# EAGLE schematic carret (EAGLE 5.06)
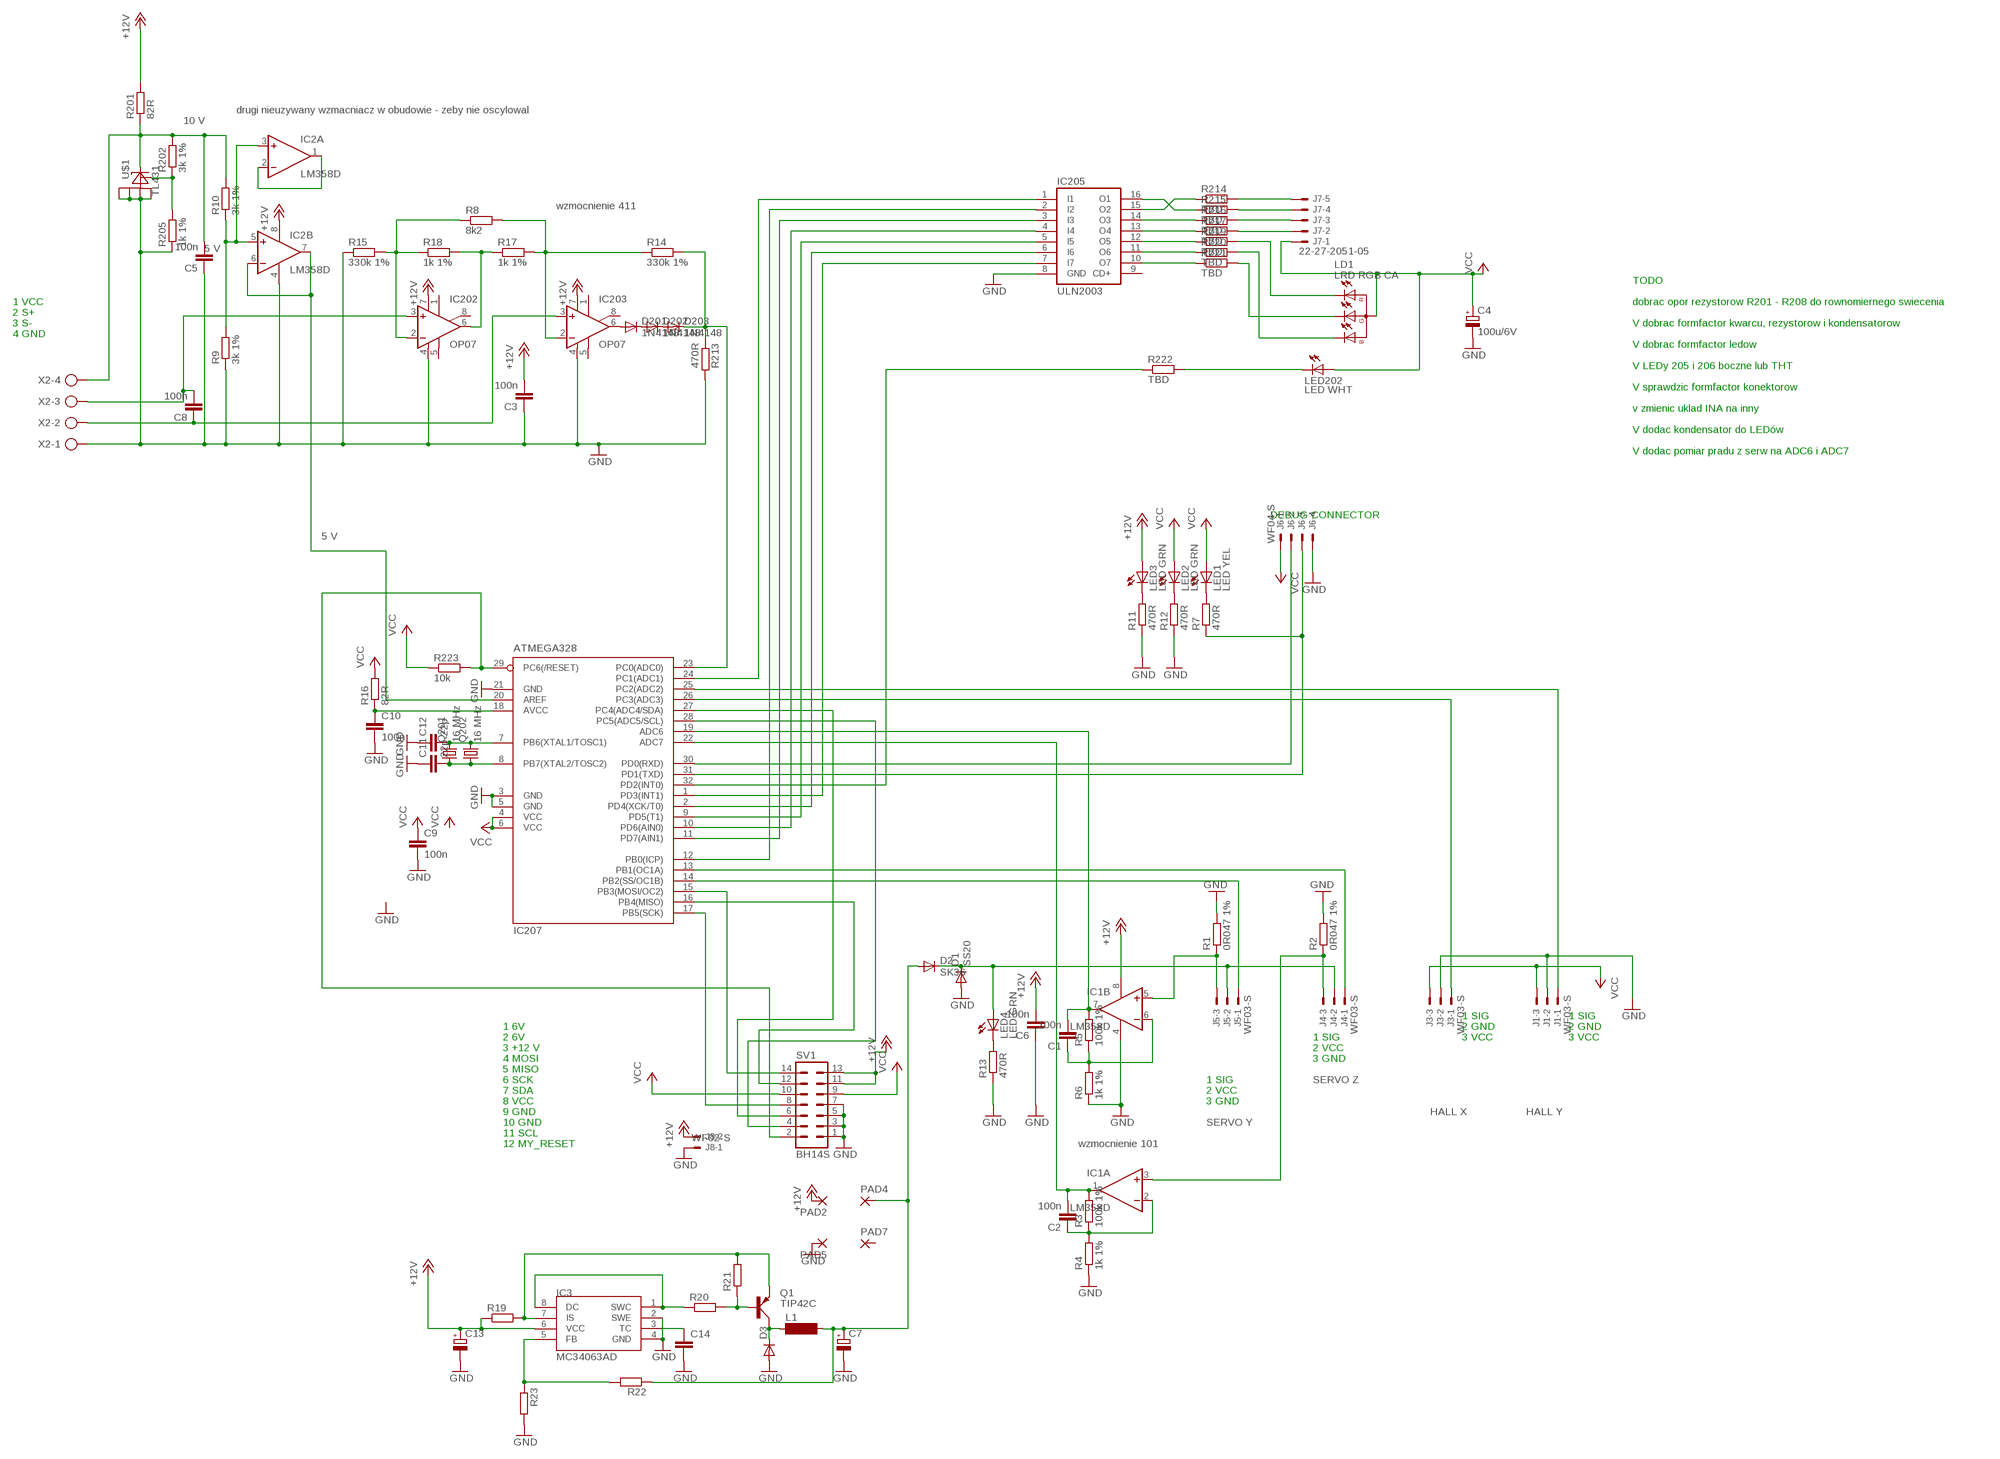
[diagram p0: schematic, sheet 1]

## Parts
C1  100n  CAP  [0805]
C2  100n  CAP  [0805]
C3  100n  CAP  [0805]
C4  100u/6V  CPOL-EUE3.5-8  [E3,5-8]
C5  100n  CAP  [0805]
C6  100n  CAP  [0805]
C7  CPOL-EUE3.5-8  [E3,5-8]
C8  100n  CAP  [0805]
C9  100n  CAP  [0805]
C10  100n  CAP  [0805]
C11  22p  CAP  [0805]
C12  22p  CAP  [0805]
C13  CPOL-EUE3.5-8  [E3,5-8]
C14  CAP  [0805]
D1  SS20  DIODE-DO214AA  [DO214AA]
D2  SK36  DIODE-SMC  [SMC]
D3  DIODE-SMB  [SMB]
D201  1N4148  DIODE-SOD80C  [SOD80C]
D202  1N4148  DIODE-SOD80C  [SOD80C]
D203  1N4148  DIODE-SOD80C  [SOD80C]
IC1  LM358D  [SO08]
IC2  LM358D  [SO08]
IC3  MC34063AD  [SOIC8]
IC202  OP07  OP07CR  [SO08]
IC203  OP07  OP07CR  [SO08]
IC205  ULN2003  ULN2003AD  [SO16]
IC207  ATMEGA328  MEGA8-AI  [TQFP32-08]
J1  WF03-S  22-27-2031-03  [6410-03]
J3  WF03-S  22-27-2031-03  [6410-03]
J4  WF03-S  22-27-2031-03  [6410-03]
J5  WF03-S  22-27-2031-03  [6410-03]
J6  WF04-S  22-27-2041-04  [6410-04]
J7  22-27-2051-05  [6410-05]
J8  WF02-S  22-27-2021-02  [6410-02]
L1  BS75  [BS75]
LD1  LRD RGB CA  LED-RGB-CA  [LED-5-RGB]
LED1  LED YEL  LED  [0805_DIODE]
LED2  LED GRN  LED  [0805_DIODE]
LED3  LED GRN  LED  [0805_DIODE]
LED4  LED GRN  LED  [0805_DIODE]
LED202  LED WHT  LED5MM  [LED5MM]
PAD2  3,81/1,1  [3,81/1,1]
PAD4  3,81/1,1  [3,81/1,1]
PAD5  3,81/1,1  [3,81/1,1]
PAD7  3,81/1,1  [3,81/1,1]
Q1  TIP42C  [TO220AV]
Q201  16 MHz  CRYSTALHC49UP  [HC49UP]
Q202  16 MHz  CRYSTALHC49U-V  [HC49U-V]
R1  0R047 1%  R-EU_R1206  [R1206]
R2  0R047 1%  R-EU_R1206  [R1206]
R3  100k 1%  RES0805  [0805]
R4  1k 1%  RES0805  [0805]
R5  100k 1%  RES0805  [0805]
R6  1k 1%  RES0805  [0805]
R7  470R  RES0805  [0805]
R8  8k2  RES0805  [0805]
R9  3k 1%  RES0805  [0805]
R10  3k 1%  RES0805  [0805]
R11  470R  RES0805  [0805]
R12  470R  RES0805  [0805]
R13  470R  RES0805  [0805]
R14  330k 1%  RES0805  [0805]
R15  330k 1%  RES0805  [0805]
R16  82R  RES0805  [0805]
R17  1k 1%  RES0805  [0805]
R18  1k 1%  RES0805  [0805]
R19  RES0805  [0805]
R20  RES0805  [0805]
R21  RES0805  [0805]
R22  RES0805  [0805]
R23  RES0805  [0805]
R201  82R  RES0805  [0805]
R202  3k 1%  RES0805  [0805]
R205  1k 1%  RES0805  [0805]
R213  470R  RES0805  [0805]
R214  TBD  RES0805  [0805]
R215  TBD  RES0805  [0805]
R216  TBD  RES0805  [0805]
R217  TBD  RES0805  [0805]
R219  TBD  RES0805  [0805]
R220  TBD  RES0805  [0805]
R221  TBD  RES0805  [0805]
R222  TBD  RES0805  [0805]
R223  10k  RES0805  [0805]
SV1  BH14S  ML14  [ML14]
U$1  TL431  [SO08]
X2  AK300/4  [AK300/4]

## Nets
+6V: C7.+ D2.A L1.2 PAD4.1(P) R22.1
+10V: C5.2 R10.2 R201.1 R202.2 U$1.1(K) X2.4
+12V: C3.2 C6.2 C13.+ IC1.8(P:V+) IC2.8(P:V+) IC3.6(VCC) IC202.7(V+) IC203.7(V+) J8.2 LED3.2(A) PAD2.1(P) R19.1 R201.2 SV1.11 SV1.13
GND: C3.1 C4.- C5.1 C6.1 C7.- C9.2 C10.2 C11.1 C12.1 C13.- C14.2 D1.A D3.A IC1.4(P:V-) IC2.4(P:V-) IC3.2(SWE) IC3.4(GND) IC202.4(V-) IC203.4(V-) IC205.8(GND) IC207.3(GND) IC207.5(GND) IC207.21(GND) J1.2 J3.2 J6.4 J8.1 PAD5.1(P) R1.2 R2.2 R4.1 R6.1 R9.1 R11.1 R12.1 R13.1 R15.1 R23.2 R205.1 R213.2 SV1.1 SV1.3 SV1.5 SV1.7 U$1.2(A) U$1.3(A1) U$1.6(A2) U$1.7(A3) X2.1
N$1: J7.5 R214.2
N$2: J7.4 R215.2
N$3: IC205.16(O1) R215.1
N$4: IC205.15(O2) R214.1
N$5: IC205.14(O3) R216.1
N$6: IC205.10(O7) R221.1
N$7: LD1.1(RC) R219.2
N$8: LD1.3(BC) R220.2
N$9: LD1.4(GC) R221.2
N$10: IC207.29(PC6(/RESET)) R223.2 SV1.2
N$11: D1.C D2.C J4.2 J5.2 LED4.2(A)
N$12: IC205.4(I4) IC207.10(PD6(AIN0))
N$13: IC205.1(I1) IC207.24(PC1(ADC1))
N$14: IC205.2(I2) IC207.12(PB0(ICP))
N$15: IC205.13(O4) R217.1
N$16: IC205.12(O5) R219.1
N$17: IC205.11(O6) R220.1
N$18: IC205.3(I3) IC207.11(PD7(AIN1))
N$19: IC205.5(I5) IC207.9(PD5(T1))
N$20: IC205.6(I6) IC207.2(PD4(XCK/T0))
N$21: IC207.32(PD2(INT0)) R222.1
N$22: IC205.7(I7) IC207.1(PD3(INT1))
N$23: LED202.K(C) R222.2
N$24: IC207.14(PB2(SS/OC1B)) J5.1
N$25: IC207.13(PB1(OC1A)) J4.1
N$26: IC207.25(PC2(ADC2)) J1.1
N$27: C11.2 IC207.8(PB7(XTAL2/TOSC2)) Q201.1 Q202.1
N$28: IC207.26(PC3(ADC3)) J3.1
N$29: IC1.5(B:+IN) J5.3 R1.1
N$30: IC1.3(A:+IN) J4.3 R2.1
N$31: C2.2 IC1.1(A:OUT) IC207.22(ADC7) R3.2
N$32: J7.3 R216.2
N$33: J7.2 R217.2
N$34: IC207.28(PC5(ADC5/SCL)) SV1.4
N$35: IC207.15(PB3(MOSI/OC2)) SV1.14
N$36: LED3.1(C) R11.2
N$37: C1.2 IC1.7(B:OUT) IC207.19(ADC6) R5.2
N$38: IC207.30(PD0(RXD)) J6.2
N$39: IC207.31(PD1(TXD)) J6.3 R7.1
N$40: LED1.1(C) R7.2
N$41: D203.C IC207.23(PC0(ADC0)) R14.2 R213.1
N$42: IC207.16(PB4(MISO)) SV1.12
N$43: R202.1 R205.2 U$1.8(REF)
N$44: IC207.17(PB5(SCK)) SV1.8
N$45: IC207.27(PC4(ADC4/SDA)) SV1.6
N$46: C12.2 IC207.7(PB6(XTAL1/TOSC1)) Q201.2 Q202.2
N$47: LED4.1(C) R13.2
N$48: C1.1 IC1.6(B:-IN) R5.1 R6.2
N$49: C8.2 IC202.3(+IN) X2.3
N$50: C8.1 IC203.3(+IN) X2.2
N$51: IC202.2(-IN) R8.1 R15.2 R18.1
N$52: IC202.6(OUT) R17.1 R18.2
N$53: IC203.2(-IN) R8.2 R14.1 R17.2
N$54: D201.A IC203.6(OUT)
N$55: D201.C D202.A
N$56: D202.C D203.A
N$57: C10.1 IC207.18(AVCC) R16.1
N$58: IC2.3(A:+IN) IC2.5(B:+IN) R9.2 R10.1
N$59: IC2.6(B:-IN) IC2.7(B:OUT) IC207.20(AREF)
N$60: IC2.1(A:OUT) IC2.2(A:-IN)
N$61: C2.1 IC1.2(A:-IN) R3.1 R4.2
N$63: LED2.1(C) R12.2
N$64: IC3.7(IS) Q1.E R19.2 R21.2
N$65: IC3.1(SWC) IC3.8(DC) R20.1
N$66: Q1.B R20.2 R21.1
N$67: C14.1 IC3.3(TC)
N$68: IC3.5(FB) R22.2 R23.1
N$71: D3.C L1.1 Q1.C
VCC: C4.+ C9.1 IC207.4(VCC) IC207.6(VCC) J1.3 J3.3 J6.1 J7.1 LD1.2(A) LED1.2(A) LED2.2(A) LED202.A R16.2 R223.1 SV1.9 SV1.10
Unconnected: IC202.1(ON1) IC202.5(OPT) IC202.8(ON2) IC203.1(ON1) IC203.5(OPT) IC203.8(ON2) IC205.9(CD+) PAD7.1(P)

## Notes on the sheet
- drugi nieuzywany wzmacniacz w obudowie - zeby nie oscylowal
- 10 V
- wzmocnienie 411
- 5 V
- TODO
- 1 VCC | dobrac opor rezystorow R201 - R208 do rownomiernego swiecenia
- 2 S+
- 3 S- | V dobrac formfactor kwarcu, rezystorow i kondensatorow
- 4 GND
- V dobrac formfactor ledow
- V LEDy 205 i 206 boczne lub THT
- V sprawdzic formfactor konektorow
- v zmienic uklad INA na inny
- V dodac kondensator do LEDów
- V dodac pomiar pradu z serw na ADC6 i ADC7
- DEBUG CONNECTOR
- 5 V
- 1 SIG | 1 SIG
- 1 6V | 2 GND | 2 GND
- 2 6V | 1 SIG | 3 VCC | 3 VCC
- 3 +12 V | 2 VCC
- 4 MOSI | 3 GND
- 5 MISO
- 6 SCK | 1 SIG | SERVO Z
- 7 SDA | 2 VCC
- 8 VCC | 3 GND
- 9 GND | HALL X | HALL Y
- 10 GND | SERVO Y
- 11 SCL
- 12 MY_RESET | wzmocnienie 101

## Library data of the parts
C1-C3 C5 C6 C8-C12 C14 = barobot:CAP
C4 C7 C13 = rcl:CPOL-EU: POLARIZED CAPACITOR, European symbol
D1-D3 D201-D203 = diode:DIODE-: DIODE
IC1 IC2 = linear:LM358: OP AMP also LM158; LM258; LM2904 Source: http://cache.national.com/ds/LM/LM158.pdf
IC3 = mc34063:MC34063
IC202 IC203 = linear:OP07*: OP AMP
IC205 = uln-udn:ULN2003A: DRIVER ARRAY
IC207 = atmel:MEGA8: MICROCONTROLLER 8 Kbytes FLASH, 1 kbytes SRAM, 512 bytes EEPROM, USART, 6-channel 10 bit ADC, 2-channel 8 bit ADC Pin compatible with Atmega48, ATMega88, ATMega168 Source: avr.lbr
J1 J3-J5 = con-molex:22-?-03: CONNECTOR wire to board 2.54 mm (.1 inch) pitch header
J6 = con-molex:22-?-04: CONNECTOR wire to board 2.54 mm (.1 inch) pitch header
J7 = con-molex:22-?-05: CONNECTOR wire to board 2.54 mm (.1 inch) pitch header
J8 = con-molex:22-?-02: CONNECTOR wire to board 2.54 mm (.1 inch) pitch header
L1 = inductor-neosid:BS: INDUCTOR nominal inductance, magnetically screened
LD1 = 0alib2:LED-RGB-CA: RGB LED 3 colors (red/green/blue), 5 mm, round, common Anode
LED1-LED4 = barobot:LED: LED
LED202 = led:LED: LED
PAD2 PAD4 PAD5 PAD7 = wirepad:3,81/1,1: THROUGH-HOLE PAD
Q1 = transistor-power:TIP42C: PNP TRANSISTOR
Q201 Q202 = crystal:CRYSTAL: CRYSTAL
R1 R2 = resistor:R-EU_: RESISTOR, European symbol
R3-R23 R201 R202 R205 R213-R217 R219-R223 = barobot:RES
SV1 = con-ml:ML14: HARTING
U$1 = 0alib:TL431
X2 = con-ptr500:AK300/4: CONNECTOR